# EAGLE design v1 (EAGLE 9.1.0)
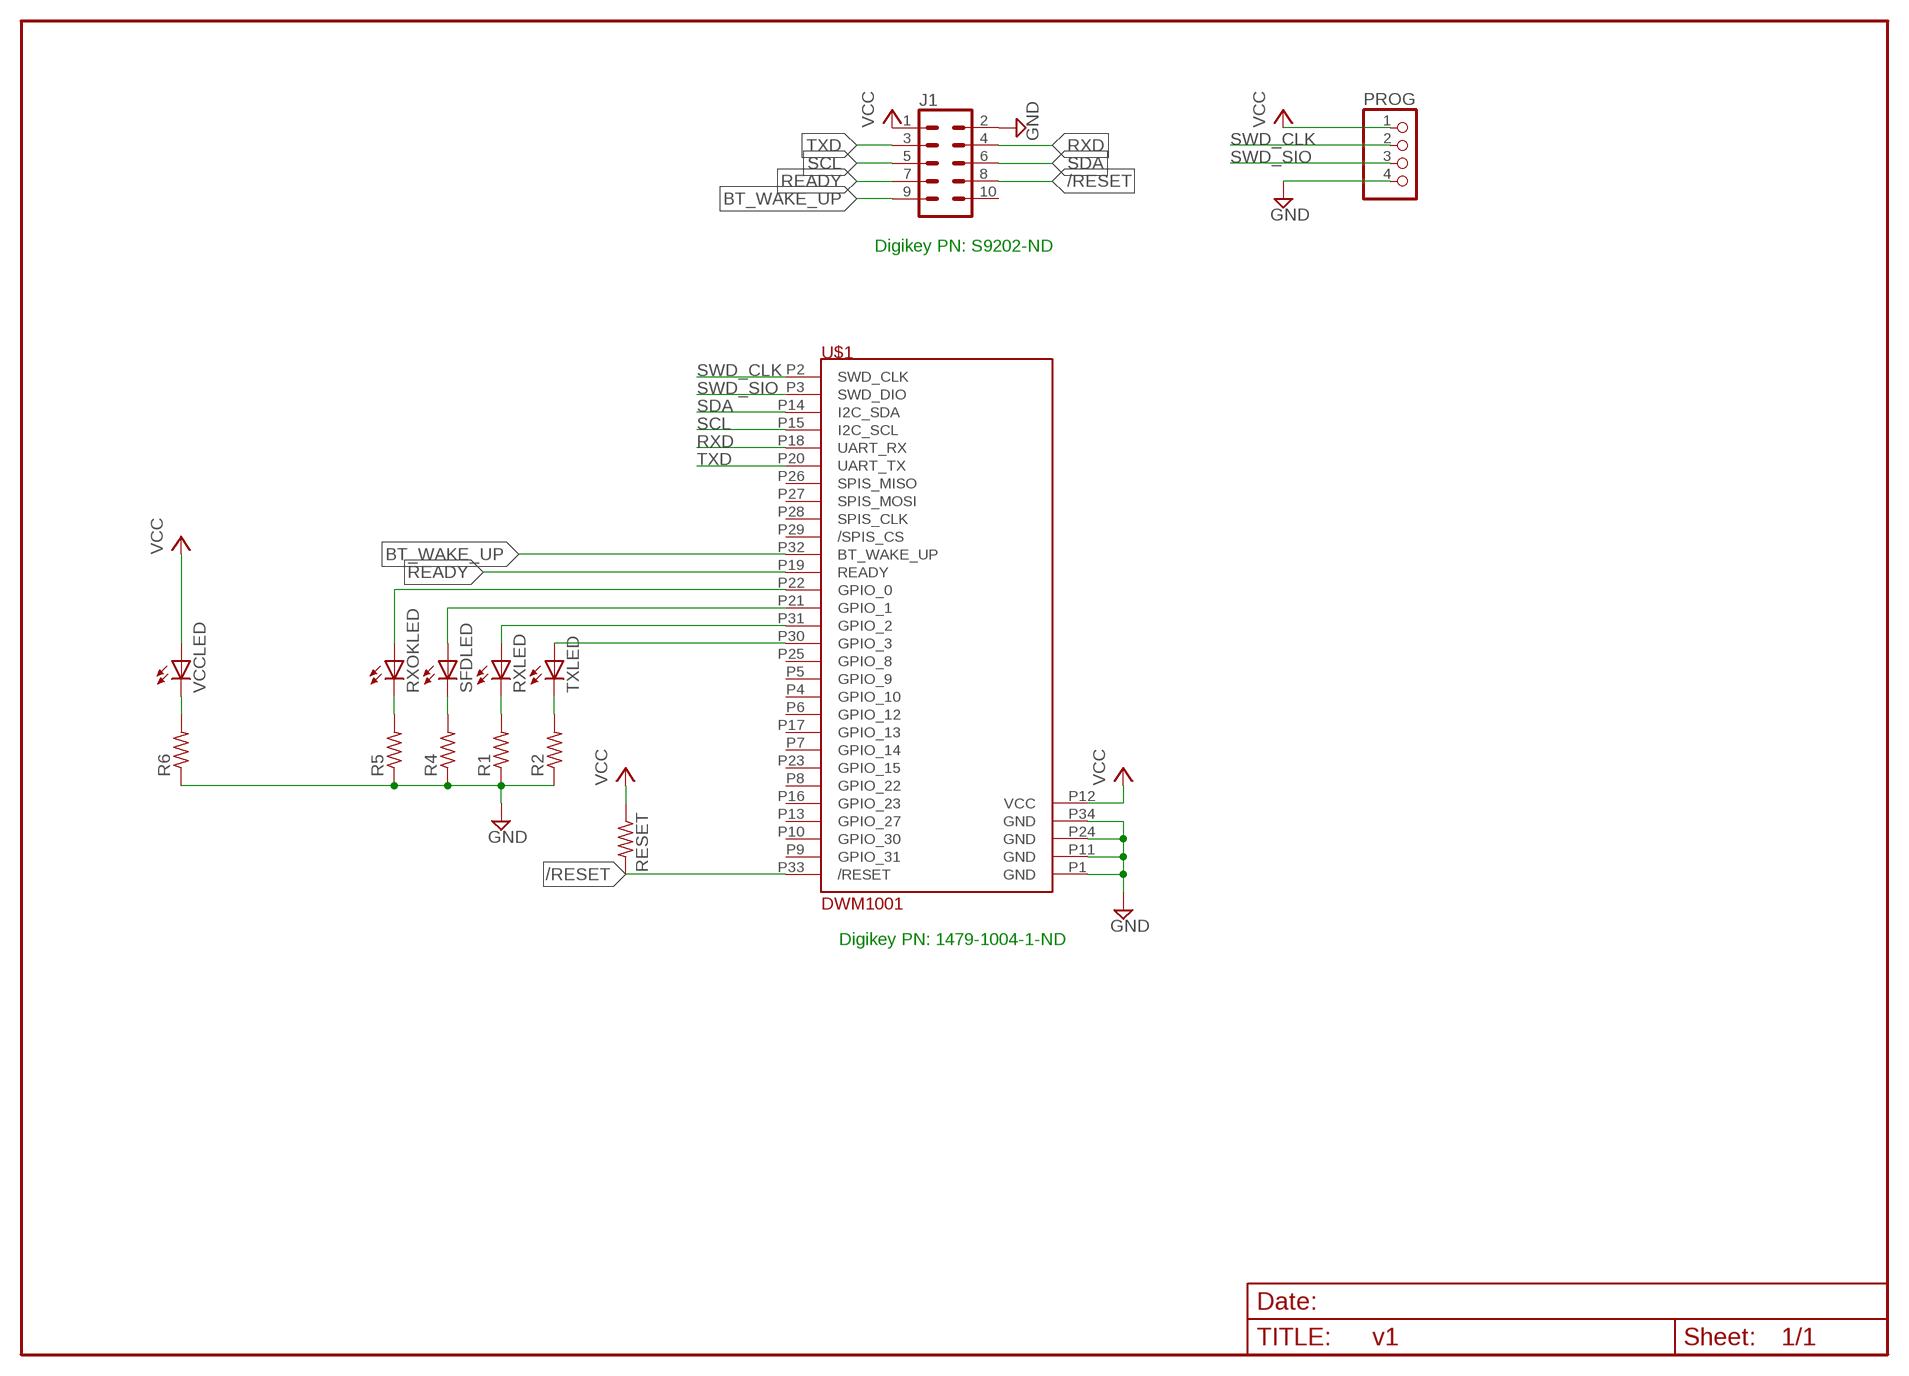
[diagram p0: schematic, sheet 1]

## Parts
J1  CONN_05X2RAF  [2X5-RAF]
PROG  PINHD-1X4  [1X04]
R1  R-US_R0603  [R0603]
R2  R-US_R0603  [R0603]
R4  R-US_R0603  [R0603]
R5  R-US_R0603  [R0603]
R6  R-US_R0603  [R0603]
RESET  R-US_R0603  [R0603]
RXLED  LEDCHIPLED_0603  [CHIPLED_0603]
RXOKLED  LEDCHIPLED_0603  [CHIPLED_0603]
SFDLED  LEDCHIPLED_0603  [CHIPLED_0603]
TXLED  LEDCHIPLED_0603  [CHIPLED_0603]
U$1  DWM1001  [DWM1001_LAND_PATTERN]
VCCLED  LEDCHIPLED_0603  [CHIPLED_0603]

## Nets
/RESET: J1.8 RESET.2 U$1.P33(/RESET)
BT_WAKE_UP: J1.9 U$1.P32(BT_WAKE_UP)
GND: J1.2 PROG.4 R1.1 R2.1 R4.1 R5.1 R6.1 U$1.P1(GND) U$1.P11(GND) U$1.P24(GND) U$1.P34(GND)
N$1: R1.2 RXLED.C
N$2: R2.2 TXLED.C
N$3: TXLED.A U$1.P30(GPIO_3)
N$4: RXLED.A U$1.P31(GPIO_2)
N$6: R4.2 SFDLED.C
N$7: R5.2 RXOKLED.C
N$8: SFDLED.A U$1.P21(GPIO_1)
N$9: RXOKLED.A U$1.P22(GPIO_0)
N$12: R6.2 VCCLED.C
READY: J1.7 U$1.P19(READY)
RXD: J1.4 U$1.P18(UART_RX)
SCL: J1.5 U$1.P15(I2C_SCL)
SDA: J1.6 U$1.P14(I2C_SDA)
SWD_CLK: PROG.2 U$1.P2(SWD_CLK)
SWD_SIO: PROG.3 U$1.P3(SWD_DIO)
TXD: J1.3 U$1.P20(UART_TX)
VCC: J1.1 PROG.1 RESET.1 U$1.P12(VCC) VCCLED.A
Unconnected: J1.10 U$1.P4(GPIO_10) U$1.P5(GPIO_9) U$1.P6(GPIO_12) U$1.P7(GPIO_14) U$1.P8(GPIO_22) U$1.P9(GPIO_31) U$1.P10(GPIO_30) U$1.P13(GPIO_27) U$1.P16(GPIO_23) U$1.P17(GPIO_13) U$1.P23(GPIO_15) U$1.P25(GPIO_8) U$1.P26(SPIS_MISO) U$1.P27(SPIS_MOSI) U$1.P28(SPIS_CLK) U$1.P29(/SPIS_CS)

## Notes on the sheet
- Digikey PN: S9202-ND
- Digikey PN: 1479-1004-1-ND

## Library data of the parts
J1 = SparkFun-Connectors:CONN_05X2: Multi connection point. Often used as Generic Header-pin footprint for 0.1 inch spaced/style header connections For AVR SPI programming port, see special device with nice symbol: "AVR_SPI_PROG_5x2.dev" You can populate with any combo of single row headers, but if you'd like an exact match, check these: 2x5 AVR ICSP Male Header <https://www.sparkfun.com/products/778> (PRT-00778) 2x5 Pin Shrouded Header <https://www.sparkfun.com/products/8506> (PRT-08506) On any of the 0.1 inch spaced packages, you can populate with these: Break Away Headers - Straight <https://www.sparkfun.com/products/116> (PRT-00116) Break Away Male Headers - Right Angle <https://www.sparkfun.com/products/553> (PRT-00553) Female Headers <https://www.sparkfun.com/products/115> (PRT-00115) Break Away Headers - Machine Pin <https://www.sparkfun.com/products/117> (PRT-00117) Break Away Female Headers - Swiss Machine Pin <https://www.sparkfun.com/products/743> (PRT-00743) Special note: the shrouded connector mates well with our 5x2 ribbon cables: 2x5 Pin IDC Ribbon Cable <https://www.sparkfun.com/products/8535> (PRT-08535)
PROG = DC_LOAD_AU:PINHD-1X4: PIN HEADER
R1 R2 R4-R6 RESET = rcl:R-US_: RESISTOR, American symbol
RXLED RXOKLED SFDLED TXLED VCCLED = RMSlib:LED: LED OSRAM: - CHIPLED LG R971, LG N971, LY N971, LG Q971, LY Q971, LO R971, LY R971 LH N974, LH R974 LS Q976, LO Q976, LY Q976 LO Q996 - Hyper CHIPLED LW Q18S LB Q993, LB Q99A, LB R99A - SideLED LS A670, LO A670, LY A670, LG A670, LP A670 LB A673, LV A673, LT A673, LW A673 LH A674 LY A675 LS A676, LA A676, LO A676, LY A676, LW A676 LS A679, LY A679, LG A679 - Hyper Micro SIDELED® LS Y876, LA Y876, LO Y876, LY Y876 LT Y87S - SmartLED LW L88C, LW L88S LB L89C, LB L89S, LG L890 LS L89K, LO L89K, LY L89K LS L896, LA L896, LO L896, LY L896 - TOPLED LS T670, LO T670, LY T670, LG T670, LP T670 LSG T670, LSP T670, LSY T670, LOP T670, LYG T670 LG T671, LOG T671, LSG T671 LB T673, LV T673, LT T673, LW T673 LH T674 LS T676, LA T676, LO T676, LY T676, LB T676, LH T676, LSB T676, LW T676 LB T67C, LV T67C, LT T67C, LS T67K, LO T67K, LY T67K, LW E67C LS E67B, LA E67B, LO E67B, LY E67B, LB E67C, LV E67C, LT E67C LW T67C LS T679, LY T679, LG T679 LS T770, LO T770, LY T770, LG T770, LP T770 LB T773, LV T773, LT T773, LW T773 LH T774 LS E675, LA E675, LY E675, LS T675 LS T776, LA T776, LO T776, LY T776, LB T776 LHGB T686 LT T68C, LB T68C - Hyper Mini TOPLED® LB M676 - Mini TOPLED Santana® LG M470 LS M47K, LO M47K, LY M47K Source: http://www.osram.convergy.de - LUMILED® LXK2-PW12-R00, LXK2-PW12-S00, LXK2-PW14-U00, LXK2-PW14-V00 LXK2-PM12-R00, LXK2-PM12-S00, LXK2-PM14-U00 LXK2-PE12-Q00, LXK2-PE12-R00, LXK2-PE12-S00, LXK2-PE14-T00, LXK2-PE14-U00 LXK2-PB12-K00, LXK2-PB12-L00, LXK2-PB12-M00, LXK2-PB14-N00, LXK2-PB14-P00, LXK2-PB14-Q00 LXK2-PR12-L00, LXK2-PR12-M00, LXK2-PR14-Q00, LXK2-PR14-R00 LXK2-PD12-Q00, LXK2-PD12-R00, LXK2-PD12-S00 LXK2-PH12-R00, LXK2-PH12-S00 LXK2-PL12-P00, LXK2-PL12-Q00, LXK2-PL12-R00 Source: www.luxeon.com
U$1 = dwm1001:DWM1001: The DWM1001 module is based on Decawave's DW1000 Ultra Wideband (UWB) transceiver IC, which is an IEEE 802.15.4-2011 UWB implementation. It integrates UWB and Bluetooth® antenna, all RF circuitry, Nordic Semiconductor nRF52832 and a motion sensor.

## Board
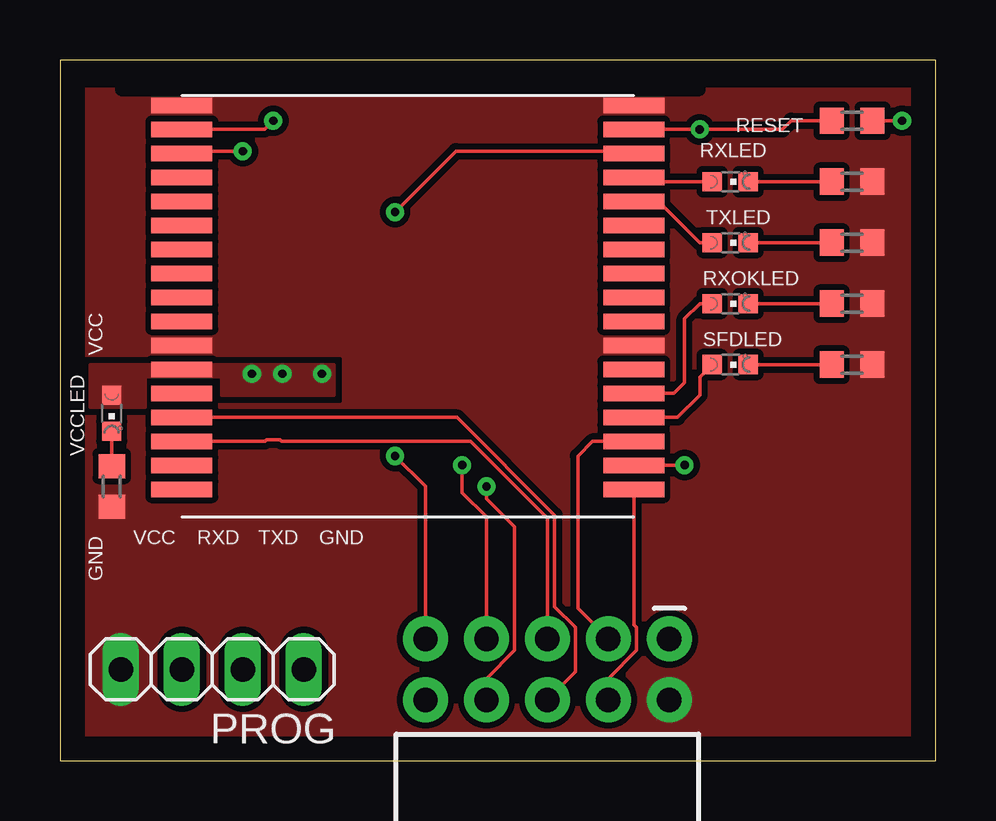
[diagram p1: board, top side]
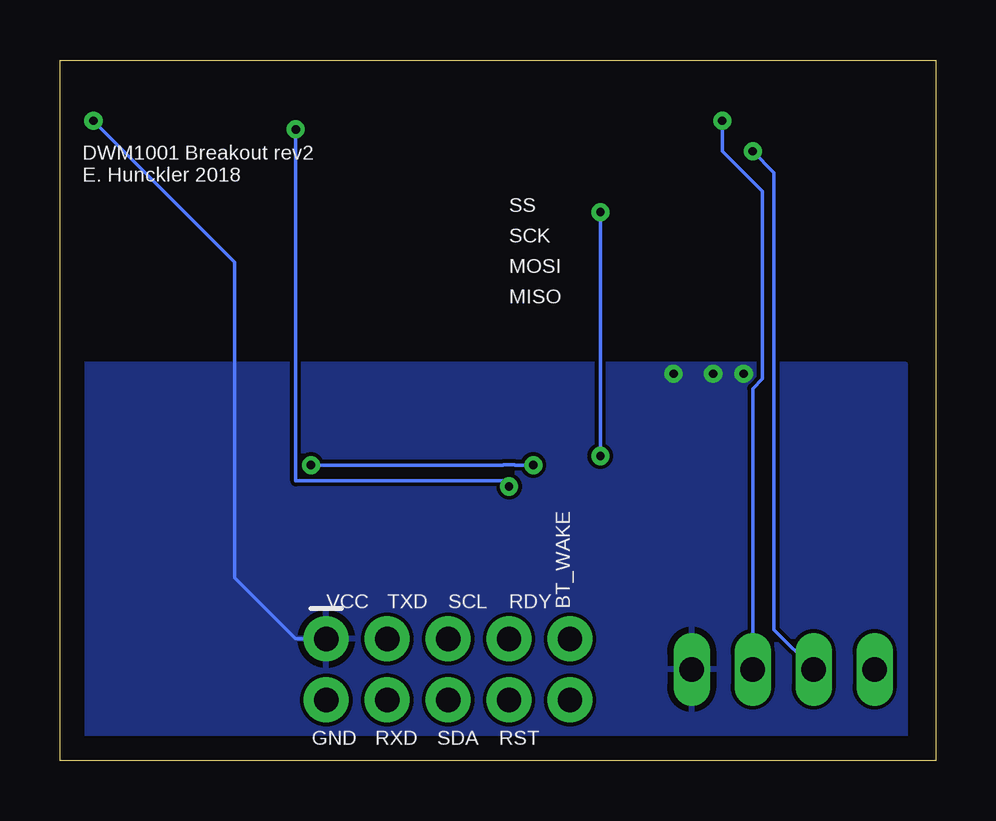
[diagram p2: board, bottom side, seen from below]

Size 36.5 x 29.2 mm. Coordinates in mm from the lower left corner, seen from the top.
Outline: 0,0 36.5,0 36.5,29.2 0,29.2 0,0
Copper layers (1*16): Top 0.035mm / dielectric 1.5mm / Bottom 0.035mm
Design rules "default": minimum track width 6mil, minimum drill 0.35mm, track to track 6mil, track to pad 6mil, pad to pad 6mil, via to via 6mil, smd to smd 6mil, copper to edge 40mil, drill to drill 6mil, minimum pad ring 10mil, minimum via ring 8mil, stop-mask expansion 4mil, vias tented up to drill 0mil, thermal gap 10mil

### Footprints (pad centres in the part's own frame; a part is rotated, then mirrored left to right if it is on the bottom)
2X5-RAF = drill 1.016 pad 1.88: 1 -1.27,5.08; 2 1.27,5.08; 3 -1.27,2.54; 4 1.27,2.54; 5 -1.27,0; 6 1.27,0; 7 -1.27,-2.54; 8 1.27,-2.54; 9 -1.27,-5.08; 10 1.27,-5.08
1X04 = drill 1.016 long: 1 -3.81,0; 2 -1.27,0; 3 1.27,0; 4 3.81,0
R0603 = smd 1 x 1.1: 1 -0.85,0; 2 0.85,0
CHIPLED_0603 = smd 0.8 x 0.8: A 0,-0.75; C 0,0.75
DWM1001_LAND_PATTERN = smd 2.54 x 0.65: P1 0,17.15; P2 0,16.15; P3 0,15.15; P4 0,14.15; P5 0,13.15; P6 0,12.15; P7 0,11.15; P8 0,10.15; P9 0,9.15; P10 0,8.15; P11 0,7.15; P12 0,6.15; P13 0,5.15; P14 0,4.15; P15 0,3.15; P16 0,2.15; P17 0,1.15; P18 18.84,1.15; P19 18.84,2.15; P20 18.84,3.15; P21 18.84,4.15; P22 18.84,5.15; P23 18.84,6.15; P24 18.84,7.15; P25 18.84,8.15; P26 18.84,9.15; P27 18.84,10.15; P28 18.84,11.15; P29 18.84,12.15; P30 18.84,13.15; P31 18.84,14.15; P32 18.84,15.15; P33 18.84,16.15; P34 18.84,17.15

### Placement (x,y rotation side)
J1  20.32,3.81 270 top
PROG  6.35,3.81 180 top
R1  33.02,24.13 180 top
R2  33.02,21.59 180 top
R4  33.02,16.51 180 top
R5  33.02,19.05 180 top
R6  2.16,11.43 90 top
RESET  33.02,26.67 180 top
RXLED  27.94,24.13 270 top
RXOKLED  27.94,19.05 270 top
SFDLED  27.94,16.51 270 top
TXLED  27.94,21.59 270 top
U$1  5.08,10.16 0 top
VCCLED  2.16,14.48 180 top

### Tracks (layer width: path | path; a pad name or v marks a point on that pad's centre or on a via)
/RESET  (via drill 0.35)
  Top 0.152: J1.8 17.78,3.43 18.95,4.6 18.95,9.75 17.78,10.92 v17.78,11.43 | U$1.P33 v26.67,26.31 30.12,26.31 30.48,26.67 RESET.2
  Bottom 0.152: v26.67,26.31 26.67,11.66 18.01,11.66 v17.78,11.43
BT_WAKE_UP  (via drill 0.35)
  Top 0.152: v13.97,22.86 16.51,25.4 23.83,25.4 U$1.P32 | J1.9 15.24,11.43 v13.97,12.7
  Bottom 0.152: v13.97,12.7 v13.97,22.86
GND
  pour Top (isolate 0.254, rank 6, no thermals): 0,0 0,27.94 36.83,27.94 36.83,0
N$1
  Top 0.152: RXLED.C R1.2
N$2
  Top 0.152: TXLED.C R2.2
N$3
  Top 0.152: U$1.P30 24.95,23.31 26.67,21.59 TXLED.A
N$4
  Top 0.152: RXLED.A 24.1,24.13 U$1.P31
N$6
  Top 0.152: SFDLED.C R4.2
N$7
  Top 0.152: RXOKLED.C R5.2
N$8
  Top 0.152: U$1.P21 25.74,14.31 26.67,15.24 26.67,15.99 SFDLED.A
N$9
  Top 0.152: U$1.P22 25.6,15.31 26.04,15.75 26.04,18.41 26.67,19.05 RXOKLED.A
N$12
  Top 0.152: VCCLED.C R6.2
READY  (via drill 0.35)
  Top 0.152: U$1.P19 26.03,12.31 v26.04,12.32 | J1.7 17.78,10.16 16.76,11.18 v16.76,12.32
  Bottom 0.152: v16.76,12.32 17.54,12.32 17.56,12.34 18,12.34 18.02,12.32 v26.04,12.32
RXD
  Top 0.152: J1.4 22.86,3.43 24.03,4.6 24.03,5.56 23.92,5.67 U$1.P18
  Bottom 0.152: J1.4 22.86,3.43
SCL
  Top 0.152: J1.5 20.32,10.11 17.12,13.31 9.23,13.31 9.17,13.37 8.61,13.37 8.55,13.31 U$1.P15
SDA
  Top 0.152: U$1.P14 16.55,14.31 20.62,10.24 20.62,6.43 21.49,5.56 21.49,3.71 J1.6
SWD_CLK  (via drill 0.35)
  Top 0.152: U$1.P2 8.53,26.31 v8.89,26.67
  Bottom 0.152: PROG.2 7.62,15.5 7.21,15.91 7.21,23.73 8.89,25.4 v8.89,26.67
SWD_SIO  (via drill 0.35)
  Top 0.152: U$1.P3 5.17,25.4 v7.62,25.4
  Bottom 0.152: v7.62,25.4 6.73,24.51 6.73,5.46 PROG.3
TXD
  Top 0.152: U$1.P20 22.2,13.31 21.59,12.7 21.59,6.35 J1.3
VCC  (via drill 0.35)
  Top 0.152: RESET.1 v35.11,26.67
  Bottom 0.152: v35.11,26.67 29.21,20.77 29.21,7.62 26.67,5.08 J1.1
  other vias: 8,16.13 9.27,16.13 10.92,16.13
  pour Bottom: 1.27,16.51 35.56,16.51 35.56,0 1.27,0
  pour Top (no thermals): 1.27,16.51 11.43,16.51 11.43,15.24 6.73,15.24 6.73,16 3.56,16 3.56,14.73 1.27,14.73

### Text on the board
tNames: VCC | VCC | RXD | TXD | GND | GND
bNames: DWM1001 Breakout rev2 / E. Hunckler 2018 | SS | SCK | MOSI | MISO | BT_WAKE | RDY | SCL | TXD | VCC | RST | SDA | RXD | GND